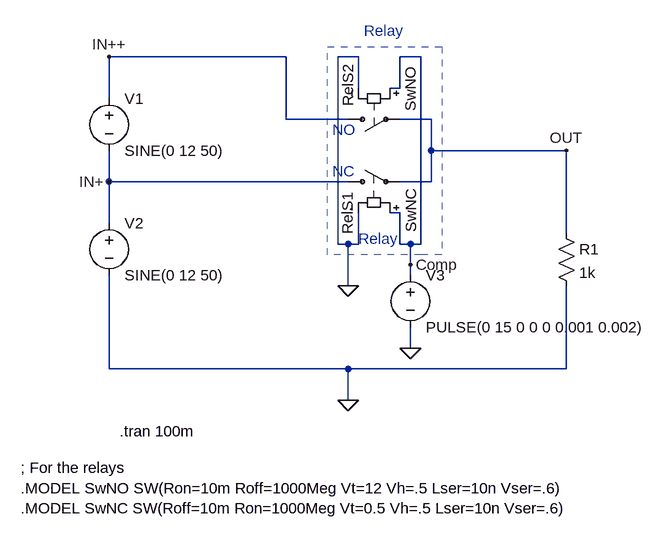
[diagram p0: schematic Relay test.asc]
Relay test.asc, the LTspice schematic file:
Version 4
SHEET 1 880 720
WIRE -112 16 -384 16
WIRE 0 16 -32 16
WIRE 96 16 64 16
WIRE 0 64 0 16
WIRE 64 64 64 16
WIRE 64 64 48 64
WIRE -384 80 -384 16
WIRE -112 112 -112 16
WIRE -16 112 -112 112
WIRE 112 112 64 112
WIRE 112 160 112 112
WIRE 320 160 112 160
WIRE -384 208 -384 160
WIRE -16 208 -384 208
WIRE 112 208 112 160
WIRE 112 208 64 208
WIRE 64 256 48 256
WIRE -384 272 -384 208
WIRE 320 288 320 160
WIRE -32 304 -32 16
WIRE -16 304 -32 304
WIRE 0 304 0 256
WIRE 0 304 -16 304
WIRE 64 304 64 256
WIRE 80 304 64 304
WIRE 96 304 96 16
WIRE 96 304 80 304
WIRE 80 336 80 304
WIRE 80 352 80 336
WIRE -16 368 -16 304
WIRE 80 464 80 432
WIRE -384 496 -384 352
WIRE -16 496 -384 496
WIRE 320 496 320 368
WIRE 320 496 -16 496
WIRE -16 544 -16 496
FLAG -16 544 0
FLAG -16 368 0
FLAG 80 464 0
FLAG 320 160 OUT
FLAG -384 16 IN++
FLAG -384 208 IN+
FLAG 80 336 Comp
SYMBOL sw -32 208 R270
WINDOW 0 -16 15 Right 2
WINDOW 3 -11 113 Right 2
SYMATTR InstName RelS1
SYMATTR Value SwNC
SYMBOL sw -32 112 M90
WINDOW 0 -85 16 Left 2
WINDOW 3 -81 112 Left 2
SYMATTR InstName RelS2
SYMATTR Value SwNO
SYMBOL voltage -384 64 R0
WINDOW 123 0 0 Left 0
WINDOW 39 0 0 Left 0
SYMATTR InstName V1
SYMATTR Value SINE(0 12 50)
SYMBOL voltage -384 256 R0
WINDOW 123 0 0 Left 0
WINDOW 39 0 0 Left 0
SYMATTR InstName V2
SYMATTR Value SINE(0 12 50)
SYMBOL res 304 272 R0
SYMATTR InstName R1
SYMATTR Value 1k
SYMBOL voltage 80 336 R0
WINDOW 123 0 0 Left 0
WINDOW 39 0 0 Left 0
SYMATTR InstName V3
SYMATTR Value PULSE(0 15 0 0 0 0.001 0.002)
TEXT 0 296 Left 2 ;Relay
TEXT -40 192 Left 2 ;NC
TEXT -40 128 Left 2 ;NO
TEXT 8 -24 Left 2 ;Relay
TEXT -368 592 Left 2 !.tran 100m
TEXT -520 648 Left 2 !; For the relays\n.MODEL SwNO SW(Ron=10m Roff=1000Meg Vt=12 Vh=.5 Lser=10n Vser=.6)\n.MODEL SwNC SW(Roff=10m Ron=1000Meg Vt=0.5 Vh=.5 Lser=10n Vser=.6)
LINE Normal -48 0 128 0 2
LINE Normal -48 320 -48 0 2
LINE Normal 96 320 -48 320 2
LINE Normal 128 320 96 320 2
LINE Normal 128 0 128 320 2

The netlist it stands for:
* Relay test.asc
S§RelS1 IN+ OUT Comp 0 SwNC
S§RelS2 IN++ OUT Comp 0 SwNO
V1 IN++ IN+ SINE(0 12 50)
V2 IN+ 0 SINE(0 12 50)
R1 OUT 0 1k
V3 Comp 0 PULSE(0 15 0 0 0 0.001 0.002)
* Relay
* NC
* NO
* Relay
.tran 100m
; For the relays
.MODEL SwNO SW(Ron=10m Roff=1000Meg Vt=12 Vh=.5 Lser=10n Vser=.6)
.MODEL SwNC SW(Roff=10m Ron=1000Meg Vt=0.5 Vh=.5 Lser=10n Vser=.6)
.backanno
.end